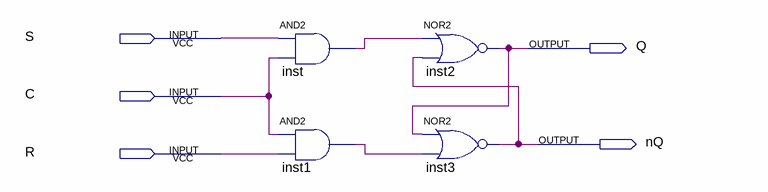
[diagram p0: schematic sheet]
// Quartus schematic SR.bdf as structural Verilog: 4 symbols, 5 pins
module SR (
  input  S,
  input  C,
  input  R,
  output Q,
  output nQ
);

  wire inst1_out, inst_out;

  and inst (inst_out, S, C);
  and inst1 (inst1_out, C, R);
  nor inst2 (Q, inst_out, nQ);
  nor inst3 (nQ, Q, inst1_out);
endmodule
